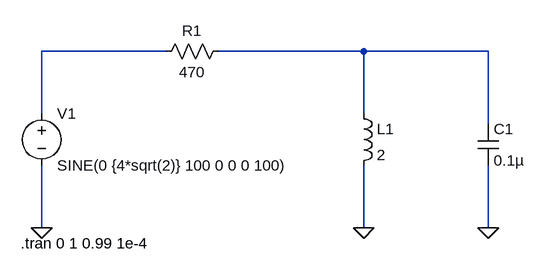
[diagram p0: schematic RLCreal.asc]
RLCreal.asc, the LTspice schematic file:
Version 4
SHEET 1 880 680
WIRE 256 32 64 32
WIRE 560 32 336 32
WIRE 752 32 560 32
WIRE 64 128 64 32
WIRE 560 128 560 32
WIRE 752 144 752 32
WIRE 64 304 64 208
WIRE 560 304 560 208
WIRE 752 304 752 208
FLAG 64 304 0
FLAG 560 304 0
FLAG 752 304 0
SYMBOL voltage 64 112 R0
WINDOW 123 0 0 Left 0
WINDOW 39 0 0 Left 0
SYMATTR InstName V1
SYMATTR Value SINE(0 {4*sqrt(2)} 100 0 0 0 100)
SYMBOL res 240 48 R270
WINDOW 0 32 56 VTop 2
WINDOW 3 0 56 VBottom 2
SYMATTR InstName R1
SYMATTR Value 470
SYMBOL ind 544 112 R0
SYMATTR InstName L1
SYMATTR Value 2
SYMBOL cap 736 144 R0
SYMATTR InstName C1
SYMATTR Value 0.1µ
TEXT 32 328 Left 2 !.tran 0 1 0.99 1e-4

The netlist it stands for:
* RLCreal.asc
V1 N001 0 SINE(0 {4*sqrt(2)} 100 0 0 0 100)
R1 N001 N002 470
L1 N002 0 2
C1 N002 0 0.1µ
.tran 0 1 0.99 1e-4
.backanno
.end